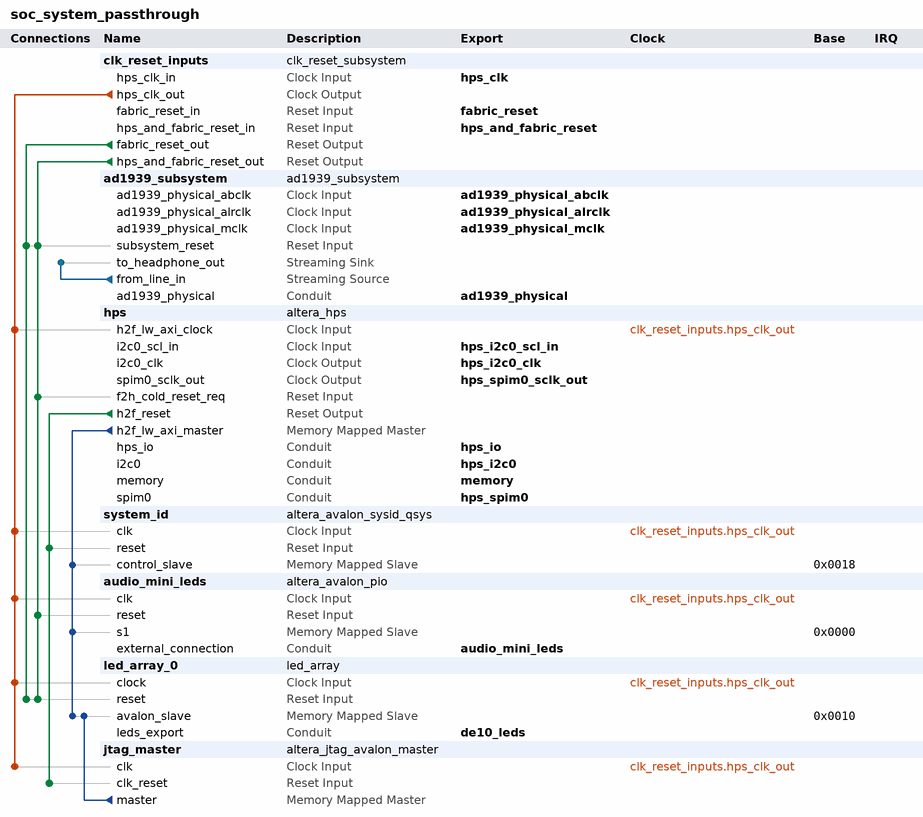
[diagram p0: system contents]
# Platform Designer (Qsys) system soc_system_passthrough, Cyclone V 5CSEBA6U23I7
# Parameters at their usual value, and those the tool derives, are not listed.
package require -exact qsys 21.1
create_system soc_system_passthrough
set_project_property DEVICE_FAMILY {Cyclone V}
set_project_property DEVICE 5CSEBA6U23I7

add_instance clk_reset_inputs clk_reset_subsystem 1.0

add_instance ad1939_subsystem ad1939_subsystem 1.0

add_instance hps altera_hps 21.1
set_instance_parameter_value hps EMAC1_Mode RGMII
set_instance_parameter_value hps EMAC1_PinMuxing {HPS I/O Set 0}
set_instance_parameter_value hps F2SCLK_COLDRST_Enable true
set_instance_parameter_value hps F2SCLK_DBGRST_Enable false
set_instance_parameter_value hps F2SCLK_WARMRST_Enable false
set_instance_parameter_value hps F2SINTERRUPT_Enable false
set_instance_parameter_value hps F2S_Width 0
set_instance_parameter_value hps FPGA_PERIPHERAL_OUTPUT_CLOCK_FREQ_EMAC0_GTX_CLK 100
set_instance_parameter_value hps FPGA_PERIPHERAL_OUTPUT_CLOCK_FREQ_EMAC0_MD_CLK 100.0
set_instance_parameter_value hps FPGA_PERIPHERAL_OUTPUT_CLOCK_FREQ_EMAC1_GTX_CLK 100
set_instance_parameter_value hps FPGA_PERIPHERAL_OUTPUT_CLOCK_FREQ_EMAC1_MD_CLK 100.0
set_instance_parameter_value hps HPS_PROTOCOL DDR3
set_instance_parameter_value hps I2C0_Mode Full
set_instance_parameter_value hps I2C0_PinMuxing FPGA
set_instance_parameter_value hps I2C1_Mode I2C
set_instance_parameter_value hps I2C1_PinMuxing {HPS I/O Set 0}
set_instance_parameter_value hps LWH2F_Enable true
set_instance_parameter_value hps MEM_BANKADDR_WIDTH 3
set_instance_parameter_value hps MEM_CLK_FREQ 400.0
set_instance_parameter_value hps MEM_COL_ADDR_WIDTH 10
set_instance_parameter_value hps MEM_DQ_WIDTH 32
set_instance_parameter_value hps MEM_DRV_STR RZQ/6
set_instance_parameter_value hps MEM_ROW_ADDR_WIDTH 15
set_instance_parameter_value hps MEM_RTT_NOM RZQ/6
set_instance_parameter_value hps MEM_RTT_WR {Dynamic ODT off}
set_instance_parameter_value hps MEM_TCL 7
set_instance_parameter_value hps MEM_TFAW_NS 37.5
set_instance_parameter_value hps MEM_TRAS_NS 35.0
set_instance_parameter_value hps MEM_TRCD_NS 13.75
set_instance_parameter_value hps MEM_TRFC_NS 300.0
set_instance_parameter_value hps MEM_TRP_NS 13.75
set_instance_parameter_value hps MEM_VENDOR Other
set_instance_parameter_value hps MEM_WTCL 7
set_instance_parameter_value hps QSPI_Mode N/A
set_instance_parameter_value hps QSPI_PinMuxing Unused
set_instance_parameter_value hps REF_CLK_FREQ 25.0
set_instance_parameter_value hps S2FCLK_USER2CLK 4
set_instance_parameter_value hps S2F_Width 0
set_instance_parameter_value hps SDIO_Mode {4-bit Data}
set_instance_parameter_value hps SDIO_PinMuxing {HPS I/O Set 0}
set_instance_parameter_value hps SPIM0_Mode Full
set_instance_parameter_value hps SPIM0_PinMuxing FPGA
set_instance_parameter_value hps SPIM1_Mode {Single Slave Select}
set_instance_parameter_value hps SPIM1_PinMuxing {HPS I/O Set 0}
set_instance_parameter_value hps STM_Enable false
set_instance_parameter_value hps TIMING_BOARD_AC_SKEW 0.02
set_instance_parameter_value hps TIMING_BOARD_AC_TO_CK_SKEW 0.0
set_instance_parameter_value hps TIMING_BOARD_DQ_TO_DQS_SKEW 0.0
set_instance_parameter_value hps TIMING_BOARD_MAX_CK_DELAY 0.6
set_instance_parameter_value hps TIMING_BOARD_MAX_DQS_DELAY 0.6
set_instance_parameter_value hps TIMING_BOARD_SKEW_BETWEEN_DQS 0.02
set_instance_parameter_value hps TIMING_BOARD_SKEW_CKDQS_DIMM_MAX 0.01
set_instance_parameter_value hps TIMING_BOARD_SKEW_CKDQS_DIMM_MIN -0.01
set_instance_parameter_value hps TIMING_BOARD_SKEW_WITHIN_DQS 0.02
set_instance_parameter_value hps TIMING_TDH 125
set_instance_parameter_value hps TIMING_TDQSCK 400
set_instance_parameter_value hps TIMING_TDQSQ 120
set_instance_parameter_value hps TIMING_TDS 50
set_instance_parameter_value hps TIMING_TIH 250
set_instance_parameter_value hps TIMING_TIS 175
set_instance_parameter_value hps TIMING_TQSH 0.38
set_instance_parameter_value hps UART0_Mode {No Flow Control}
set_instance_parameter_value hps UART0_PinMuxing {HPS I/O Set 0}
set_instance_parameter_value hps USB1_Mode SDR
set_instance_parameter_value hps USB1_PinMuxing {HPS I/O Set 0}
set_instance_parameter_value hps desired_cfg_clk_mhz 100.0
set_instance_parameter_value hps desired_mpu_clk_mhz 0.0
set_instance_parameter_value hps desired_qspi_clk_mhz 370.0

add_instance system_id altera_avalon_sysid_qsys 21.1
set_instance_parameter_value system_id id -1395322110

add_instance audio_mini_leds altera_avalon_pio 21.1
set_instance_parameter_value audio_mini_leds direction Output
set_instance_parameter_value audio_mini_leds width 4

add_instance led_array_0 led_array 1.0
set_instance_parameter_value led_array_0 n_leds 8

add_instance jtag_master altera_jtag_avalon_master 21.1

# connections
add_connection clk_reset_inputs.hps_clk_out audio_mini_leds.clk clock
add_connection clk_reset_inputs.hps_clk_out hps.h2f_lw_axi_clock clock
add_connection clk_reset_inputs.hps_clk_out jtag_master.clk clock
add_connection clk_reset_inputs.hps_clk_out led_array_0.clock clock
add_connection clk_reset_inputs.hps_clk_out system_id.clk clock
add_connection clk_reset_inputs.fabric_reset_out ad1939_subsystem.subsystem_reset reset
add_connection clk_reset_inputs.fabric_reset_out led_array_0.reset reset
add_connection clk_reset_inputs.hps_and_fabric_reset_out ad1939_subsystem.subsystem_reset reset
add_connection clk_reset_inputs.hps_and_fabric_reset_out audio_mini_leds.reset reset
add_connection clk_reset_inputs.hps_and_fabric_reset_out hps.f2h_cold_reset_req reset
add_connection clk_reset_inputs.hps_and_fabric_reset_out led_array_0.reset reset
add_connection hps.h2f_reset jtag_master.clk_reset reset
add_connection hps.h2f_reset system_id.reset reset
add_connection hps.h2f_lw_axi_master audio_mini_leds.s1 avalon
set_connection_parameter_value hps.h2f_lw_axi_master/audio_mini_leds.s1 baseAddress 0x0000
add_connection hps.h2f_lw_axi_master led_array_0.avalon_slave avalon
set_connection_parameter_value hps.h2f_lw_axi_master/led_array_0.avalon_slave baseAddress 0x0010
add_connection hps.h2f_lw_axi_master system_id.control_slave avalon
set_connection_parameter_value hps.h2f_lw_axi_master/system_id.control_slave baseAddress 0x0018
add_connection jtag_master.master led_array_0.avalon_slave avalon
set_connection_parameter_value jtag_master.master/led_array_0.avalon_slave baseAddress 0x0010
add_connection ad1939_subsystem.from_line_in ad1939_subsystem.to_headphone_out avalon_streaming

# exported interfaces
add_interface ad1939_physical conduit end
set_interface_property ad1939_physical EXPORT_OF ad1939_subsystem.ad1939_physical
add_interface ad1939_physical_abclk clock sink
set_interface_property ad1939_physical_abclk EXPORT_OF ad1939_subsystem.ad1939_physical_abclk
add_interface ad1939_physical_alrclk clock sink
set_interface_property ad1939_physical_alrclk EXPORT_OF ad1939_subsystem.ad1939_physical_alrclk
add_interface ad1939_physical_mclk clock sink
set_interface_property ad1939_physical_mclk EXPORT_OF ad1939_subsystem.ad1939_physical_mclk
add_interface audio_mini_leds conduit end
set_interface_property audio_mini_leds EXPORT_OF audio_mini_leds.external_connection
add_interface de10_leds conduit end
set_interface_property de10_leds EXPORT_OF led_array_0.leds_export
add_interface fabric_reset reset sink
set_interface_property fabric_reset EXPORT_OF clk_reset_inputs.fabric_reset_in
add_interface hps_and_fabric_reset reset sink
set_interface_property hps_and_fabric_reset EXPORT_OF clk_reset_inputs.hps_and_fabric_reset_in
add_interface hps_clk clock sink
set_interface_property hps_clk EXPORT_OF clk_reset_inputs.hps_clk_in
add_interface hps_i2c0 conduit end
set_interface_property hps_i2c0 EXPORT_OF hps.i2c0
add_interface hps_i2c0_clk clock source
set_interface_property hps_i2c0_clk EXPORT_OF hps.i2c0_clk
add_interface hps_i2c0_scl_in clock sink
set_interface_property hps_i2c0_scl_in EXPORT_OF hps.i2c0_scl_in
add_interface hps_io conduit end
set_interface_property hps_io EXPORT_OF hps.hps_io
add_interface hps_spim0 conduit end
set_interface_property hps_spim0 EXPORT_OF hps.spim0
add_interface hps_spim0_sclk_out clock source
set_interface_property hps_spim0_sclk_out EXPORT_OF hps.spim0_sclk_out
add_interface memory conduit end
set_interface_property memory EXPORT_OF hps.memory

set_interconnect_requirement {$system} qsys_mm.clockCrossingAdapter HANDSHAKE
set_interconnect_requirement {$system} qsys_mm.maxAdditionalLatency 1

save_system soc_system_passthrough.qsys
